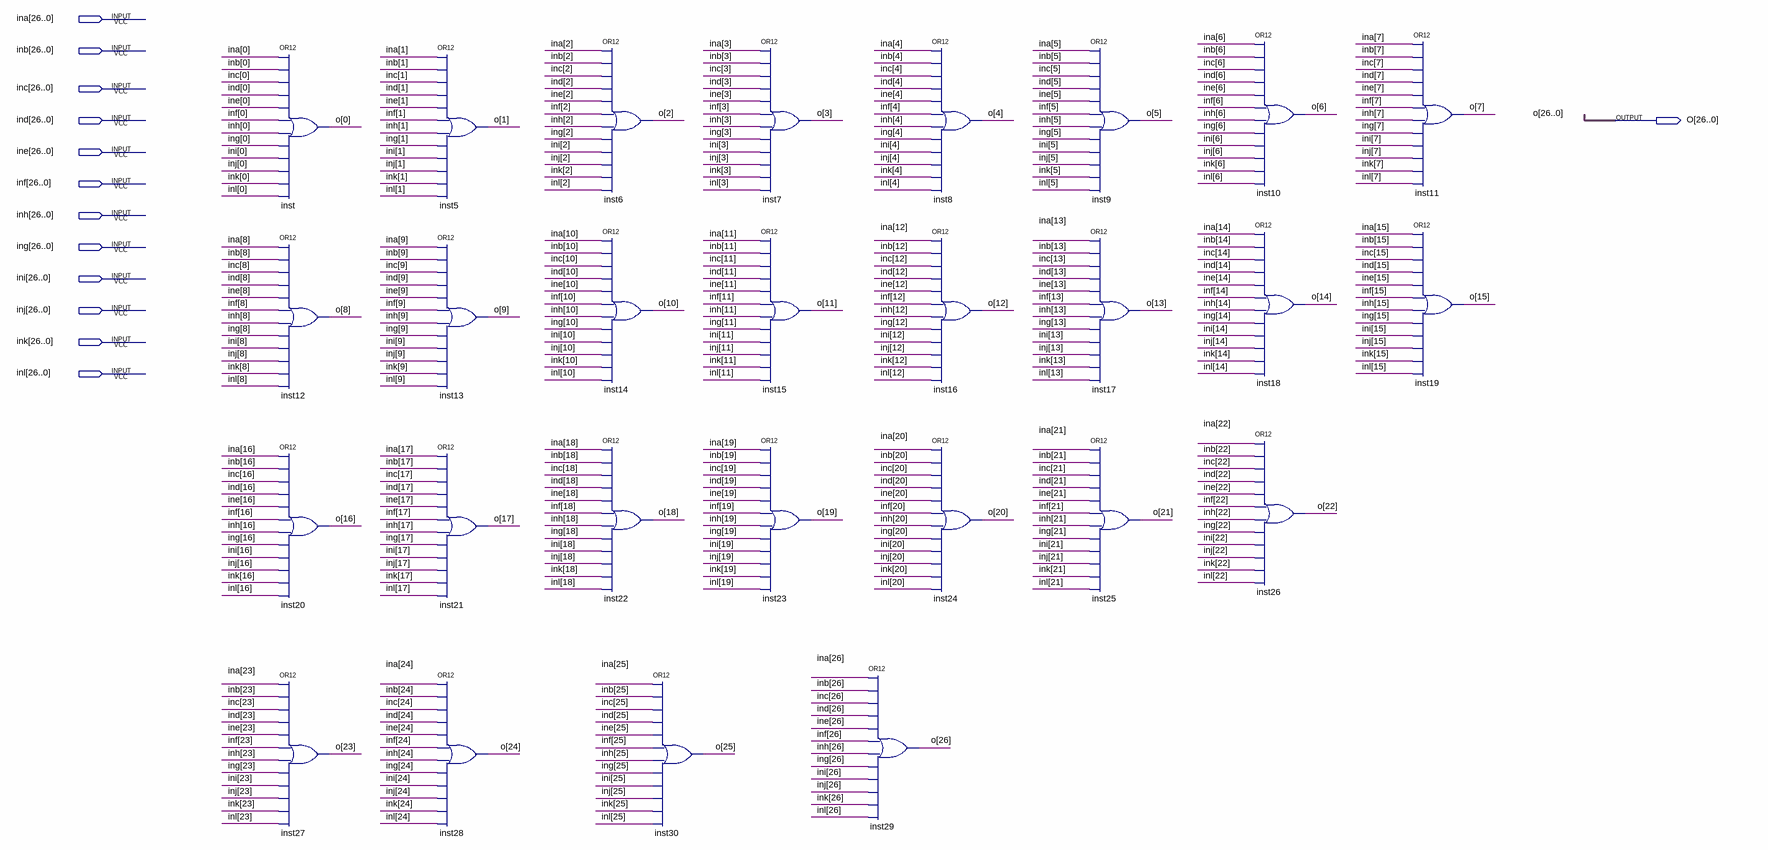
[diagram p0: schematic sheet]
// Quartus schematic OR12_26.bdf as structural Verilog: 27 symbols, 13 pins
module OR12_26 (
  input  [26:0] ina,
  input  [26:0] inb,
  input  [26:0] inc,
  input  [26:0] ind,
  input  [26:0] ine,
  input  [26:0] inf,
  input  [26:0] inh,
  input  [26:0] ing,
  input  [26:0] ini,
  input  [26:0] inj,
  input  [26:0] ink,
  input  [26:0] inl,
  output [26:0] O
);

  or inst (O[0], ina[0], inb[0], inc[0], ind[0], ine[0], inf[0], inh[0], ing[0], ini[0], inj[0], ink[0], inl[0]);
  or inst12 (O[8], ina[8], inb[8], inc[8], ind[8], ine[8], inf[8], inh[8], ing[8], ini[8], inj[8], ink[8], inl[8]);
  or inst20 (O[16], ina[16], inb[16], inc[16], ind[16], ine[16], inf[16], inh[16], ing[16], ini[16], inj[16], ink[16], inl[16]);
  or inst27 (O[23], ina[23], inb[23], inc[23], ind[23], ine[23], inf[23], inh[23], ing[23], ini[23], inj[23], ink[23], inl[23]);
  or inst5 (O[1], ina[1], inb[1], inc[1], ind[1], ine[1], inf[1], inh[1], ing[1], ini[1], inj[1], ink[1], inl[1]);
  or inst13 (O[9], ina[9], inb[9], inc[9], ind[9], ine[9], inf[9], inh[9], ing[9], ini[9], inj[9], ink[9], inl[9]);
  or inst21 (O[17], ina[17], inb[17], inc[17], ind[17], ine[17], inf[17], inh[17], ing[17], ini[17], inj[17], ink[17], inl[17]);
  or inst28 (O[24], ina[24], inb[24], inc[24], ind[24], ine[24], inf[24], inh[24], ing[24], ini[24], inj[24], ink[24], inl[24]);
  or inst6 (O[2], ina[2], inb[2], inc[2], ind[2], ine[2], inf[2], inh[2], ing[2], ini[2], inj[2], ink[2], inl[2]);
  or inst14 (O[10], ina[10], inb[10], inc[10], ind[10], ine[10], inf[10], inh[10], ing[10], ini[10], inj[10], ink[10], inl[10]);
  or inst22 (O[18], ina[18], inb[18], inc[18], ind[18], ine[18], inf[18], inh[18], ing[18], ini[18], inj[18], ink[18], inl[18]);
  or inst30 (O[25], ina[25], inb[25], inc[25], ind[25], ine[25], inf[25], inh[25], ing[25], ini[25], inj[25], ink[25], inl[25]);
  or inst7 (O[3], ina[3], inb[3], inc[3], ind[3], ine[3], inf[3], inh[3], ing[3], ini[3], inj[3], ink[3], inl[3]);
  or inst15 (O[11], ina[11], inb[11], inc[11], ind[11], ine[11], inf[11], inh[11], ing[11], ini[11], inj[11], ink[11], inl[11]);
  or inst23 (O[19], ina[19], inb[19], inc[19], ind[19], ine[19], inf[19], inh[19], ing[19], ini[19], inj[19], ink[19], inl[19]);
  or inst29 (O[26], ina[26], inb[26], inc[26], ind[26], ine[26], inf[26], inh[26], ing[26], ini[26], inj[26], ink[26], inl[26]);
  or inst8 (O[4], ina[4], inb[4], inc[4], ind[4], ine[4], inf[4], inh[4], ing[4], ini[4], inj[4], ink[4], inl[4]);
  or inst16 (O[12], ina[12], inb[12], inc[12], ind[12], ine[12], inf[12], inh[12], ing[12], ini[12], inj[12], ink[12], inl[12]);
  or inst24 (O[20], ina[20], inb[20], inc[20], ind[20], ine[20], inf[20], inh[20], ing[20], ini[20], inj[20], ink[20], inl[20]);
  or inst9 (O[5], ina[5], inb[5], inc[5], ind[5], ine[5], inf[5], inh[5], ing[5], ini[5], inj[5], ink[5], inl[5]);
  or inst17 (O[13], ina[13], inb[13], inc[13], ind[13], ine[13], inf[13], inh[13], ing[13], ini[13], inj[13], ink[13], inl[13]);
  or inst25 (O[21], ina[21], inb[21], inc[21], ind[21], ine[21], inf[21], inh[21], ing[21], ini[21], inj[21], ink[21], inl[21]);
  or inst10 (O[6], ina[6], inb[6], inc[6], ind[6], ine[6], inf[6], inh[6], ing[6], ini[6], inj[6], ink[6], inl[6]);
  or inst18 (O[14], ina[14], inb[14], inc[14], ind[14], ine[14], inf[14], inh[14], ing[14], ini[14], inj[14], ink[14], inl[14]);
  or inst26 (O[22], ina[22], inb[22], inc[22], ind[22], ine[22], inf[22], inh[22], ing[22], ini[22], inj[22], ink[22], inl[22]);
  or inst11 (O[7], ina[7], inb[7], inc[7], ind[7], ine[7], inf[7], inh[7], ing[7], ini[7], inj[7], ink[7], inl[7]);
  or inst19 (O[15], ina[15], inb[15], inc[15], ind[15], ine[15], inf[15], inh[15], ing[15], ini[15], inj[15], ink[15], inl[15]);
endmodule
